# EAGLE design sim800c (EAGLE 6.1)
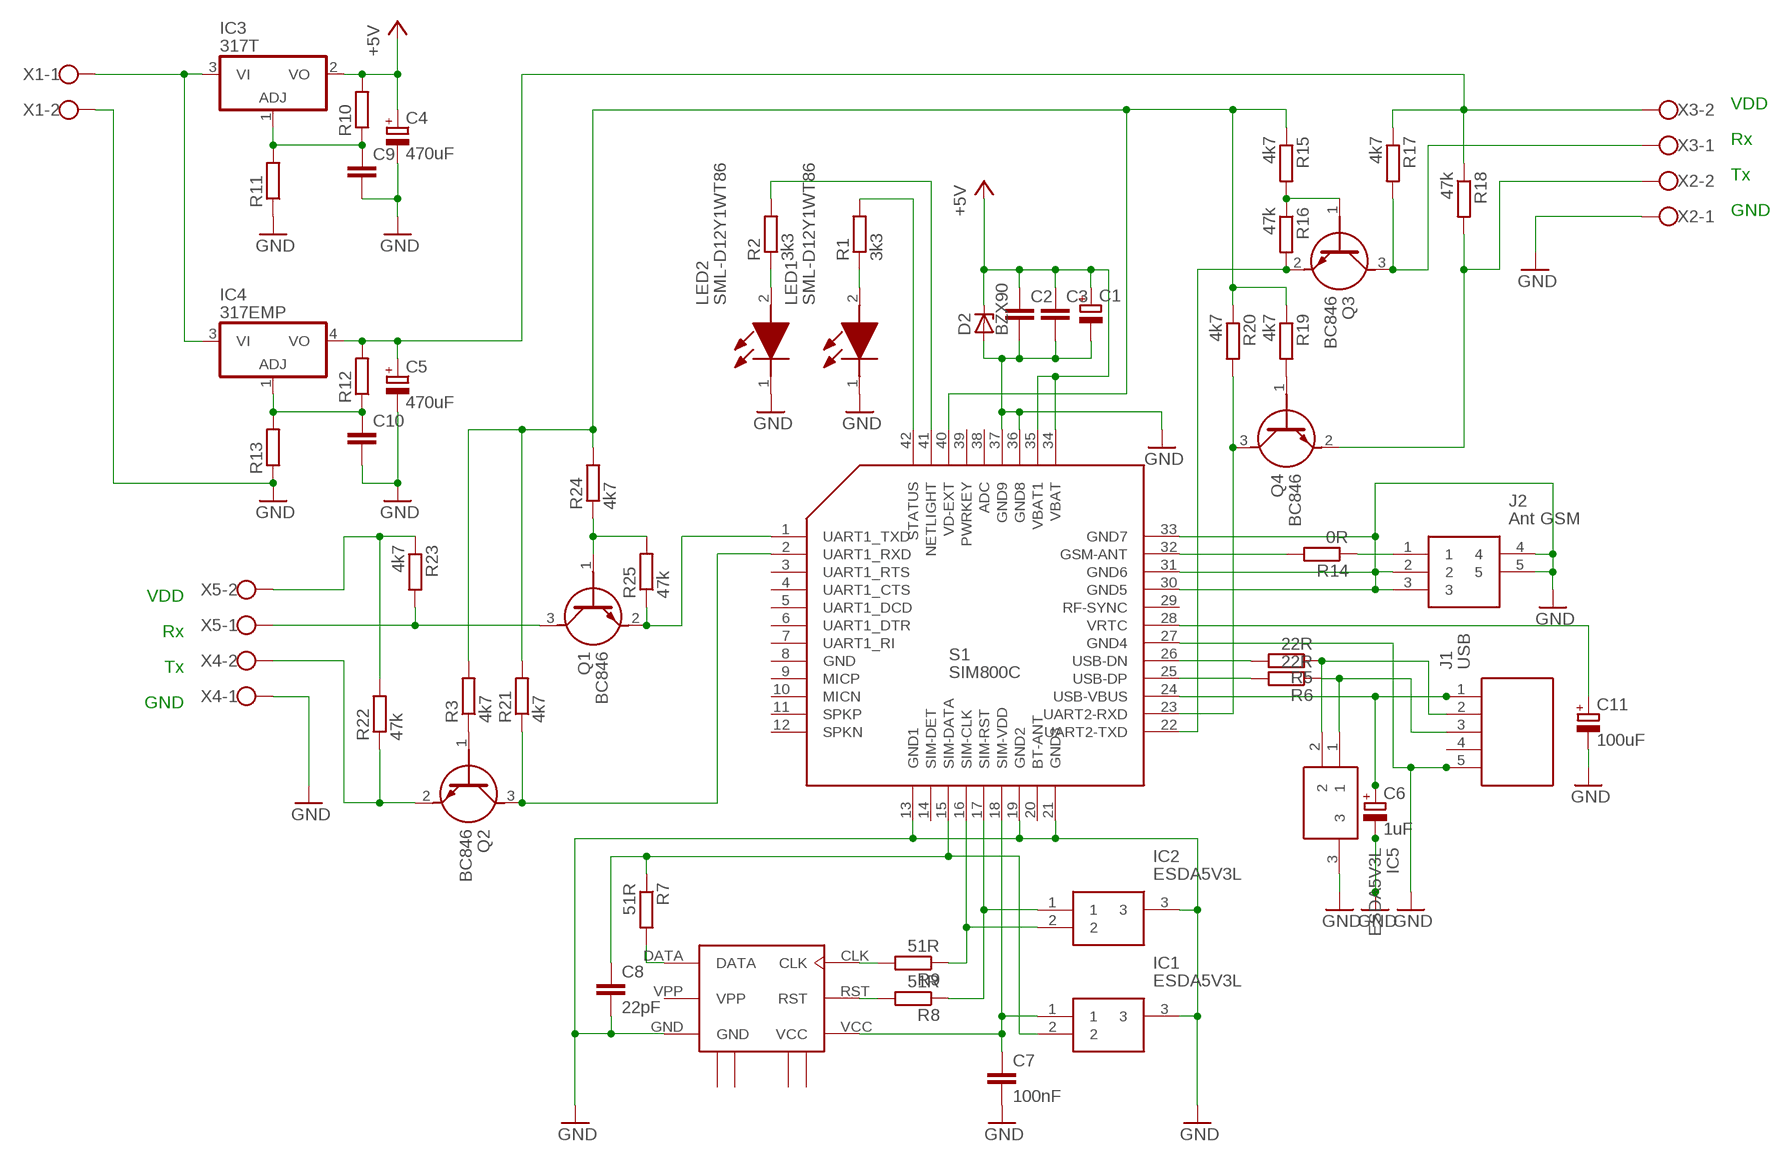
[diagram p0: schematic, sheet 1]

## Parts
C1  CPOL-EU140CLH-0810  [140CLH-0810]
C2  C-EUC0603  [C0603]
C3  C-EUC0603  [C0603]
C4  470uF  CPOL-EU140CLH-1010  [140CLH-1010]
C5  470uF  CPOL-EU140CLH-1010  [140CLH-1010]
C6  1uF  CPOL-EU153CLV-0405  [153CLV-0405]
C7  100nF  C-EUC0805  [C0805]
C8  22pF  C-EUC0805  [C0805]
C9  C-EUC0603  [C0603]
C10  C-EUC0603  [C0603]
C11  100uF  CPOL-EU140CLH-0810  [140CLH-0810]
D2  BZX90  [DO34Z7]
IC1  ESDA5V3L  [SOT105P242X150-3N]
IC2  ESDA5V3L  [SOT105P242X150-3N]
IC3  317T  [TO220H]
IC4  317EMP  [SOT223]
IC5  ESDA5V3L  [SOT105P242X150-3N]
J1  USB  ZX62R-B-5P_30_  [ZX62R-B-5P(30)]
J2  Ant GSM  1053354-1  [10533541]
LED1  SML-D12Y1WT86  [LEDC1608X55N]
LED2  SML-D12Y1WT86  [LEDC1608X55N]
Q1  BC846  BC846B,215  [SOT95P230X110-3N]
Q2  BC846  BC846B,215  [SOT95P230X110-3N]
Q3  BC846  BC846B,215  [SOT95P230X110-3N]
Q4  BC846  BC846B,215  [SOT95P230X110-3N]
R1  3k3  R-EU_M0805  [M0805]
R2  3k3  R-EU_M0805  [M0805]
R3  4k7  R-EU_M1206  [M1206]
R5  22R  R-EU_M1206  [M1206]
R6  22R  R-EU_M1206  [M1206]
R7  51R  R-EU_M1206  [M1206]
R8  51R  R-EU_M1206  [M1206]
R9  51R  R-EU_M1206  [M1206]
R10  R-EU_M1206  [M1206]
R11  R-EU_M1206  [M1206]
R12  R-EU_M1206  [M1206]
R13  R-EU_M1206  [M1206]
R14  0R  R-EU_M1206  [M1206]
R15  4k7  R-EU_M1206  [M1206]
R16  47k  R-EU_M1206  [M1206]
R17  4k7  R-EU_M1206  [M1206]
R18  47k  R-EU_M1206  [M1206]
R19  4k7  R-EU_M1206  [M1206]
R20  4k7  R-EU_M1206  [M1206]
R21  4k7  R-EU_M1206  [M1206]
R22  47k  R-EU_M1206  [M1206]
R23  4k7  R-EU_M1206  [M1206]
R24  4k7  R-EU_M1206  [M1206]
R25  47k  R-EU_M1206  [M1206]
S1  SIM800C  [SIM800C]
U$1  SCU-W0822XR-06  [SCU-W0822XR-06]
X1  W237-102  [W237-102]
X2  W237-102  [W237-102]
X3  W237-102  [W237-102]
X4  W237-102  [W237-102]
X5  W237-102  [W237-102]

## Nets
+5V: C1.+ C2.1 C3.1 C4.+ D2.C IC3.2(VO) R10.2 S1.34(VBAT) S1.35(VBAT1)
GND: C1.- C2.2 C3.2 C4.- C5.- C6.- C7.2 C8.2 C9.2 C10.2 C11.- D2.A IC1.3 IC2.3 IC5.3 J1.5 J2.2 J2.3 J2.4 J2.5 LED1.1(K) LED2.1(K) R11.1 R13.1 S1.13(GND1) S1.19(GND2) S1.21(GND3) S1.27(GND4) S1.30(GND5) S1.31(GND6) S1.33(GND7) S1.36(GND8) S1.37(GND9) U$1.GND X1.2 X2.1 X4.1
N$1: Q3.2(E) R16.2 S1.22(UART2-TXD)
N$2: R6.2 S1.25(USB-DP)
N$3: C6.+ J1.1 S1.24(USB-VBUS)
N$4: IC5.2 J1.2 R5.1
N$5: R14.2 S1.32(GSM-ANT)
N$6: LED1.2(A) R1.1
N$7: LED2.2(A) R2.1
N$8: Q1.3(C) R23.2 X5.1
N$9: Q1.1(B) R24.1 R25.2
N$10: IC5.1 J1.3 R6.1
N$12: Q2.3(C) R21.1 S1.2(UART1_RXD)
N$13: R7.2 U$1.DATA
N$14: IC2.2 R9.1 S1.16(SIM-CLK)
N$15: IC2.1 R8.1 S1.17(SIM-RST)
N$16: IC3.3(VI) IC4.3(VI) X1.1
N$17: C7.1 IC1.1 S1.18(SIM-VDD) U$1.VCC
N$18: C8.1 IC1.2 R7.1 S1.15(SIM-DATA)
N$19: C9.1 IC3.1(ADJ) R10.1 R11.2
N$20: R9.2 U$1.CLK
N$21: J2.1 R14.1
N$22: R8.2 U$1.RST
N$23: R2.2 S1.41(NETLIGHT)
N$24: R1.2 S1.42(STATUS)
N$25: C10.1 IC4.1(ADJ) R12.1 R13.2
N$26: C11.+ S1.28(VRTC)
N$27: Q3.1(B) R15.2 R16.1
N$28: C5.+ IC4.4(VO) R12.2 R17.1 R18.1 X3.2
N$29: R5.2 S1.26(USB-DN)
N$30: R3.2 R15.1 R19.1 R20.1 R21.2 R24.2 S1.40(VD-EXT)
N$31: Q2.2(E) R22.1 X4.2
N$32: Q3.3(C) R17.2 X3.1
N$33: Q2.1(B) R3.1
N$34: Q4.1(B) R19.2
N$35: Q4.3(C) R20.2 S1.23(UART2-RXD)
N$36: Q4.2(E) R18.2 X2.2
N$38: R22.2 R23.1 X5.2
S$3: Q1.2(E) R25.1 S1.1(UART1_TXD)
Unconnected: J1.4 S1.3(UART1_RTS) S1.4(UART1_CTS) S1.5(UART1_DCD) S1.6(UART1_DTR) S1.7(UART1_RI) S1.9(MICP) S1.10(MICN) S1.11(SPKP) S1.12(SPKN) S1.14(SIM-DET) S1.20(BT-ANT) S1.29(RF-SYNC) S1.38(ADC) S1.39(PWRKEY)

## Notes on the sheet
- VDD
- Rx
- Tx
- GND
- VDD
- Rx
- Tx
- GND

## Power pins joined to a net without a drawn wire
GND: S1.8(GND)
GND1: U$1.GND_1(GND1)
GND2: U$1.GND_2(GND2)
GND3: U$1.GND_3(GND3)
GND4: U$1.GND_4(GND4)
VPP: U$1.VPP

## Library data of the parts
C1 C4-C6 C11 = resistor:CPOL-EU: POLARIZED CAPACITOR, European symbol
C2 C3 C7-C10 = resistor:C-EU: CAPACITOR, European symbol
D2 = diode:BZX90: Z DIODE
IC1 IC2 IC5 = ESDA5V3L:ESDA5V3L: TVS Diode Array Uni-Directional ESDA5V3L Dual, 300W, SOT-23 3-Pin Source: Datasheet <http://www.st.com/web/en/resource/technical/document/datasheet/CD00002057.pdf>; ARROW_PART_NUMBER: ESD; ARROW_PRICE-STOCK: https://www.arrow.com/en/products/esda5v3l/stmicroelectronics; DESCRIPTION: TVS Diode Array Uni-Directional ESDA5V3L Dual, 300W, SOT-23 3-Pin; HEIGHT: 1.5mm; MANUFACTURER_NAME: STMicroelectronics; MANUFACTURER_PART_NUMBER: ESDA5V3L; MOUSER_PART_NUMBER: 511-ESDA5V3L; MOUSER_PRICE-STOCK: https://www.mouser.co.uk/ProductDetail/STMicroelectronics/ESDA5V3L?qs=bZskSr8d5Y%2FChJ9BTqyJUw%3D%3D
IC3 IC4 = linear:*317: Positive VOLTAGE REGULATOR
J1 = ZX62R-B-5P_30_:ZX62R-B-5P_30_: Hirose ZX, Straight SMT, Type B Version 2.0 Micro USB Connector Receptacle Source: Datasheet <http://www.farnell.com/datasheets/2360818.pdf>; ARROW_PART_NUMBER: ZX62R-B-5P(30); ARROW_PRICE-STOCK: https://www.arrow.com/en/products/zx62r-b-5p-30/hirose-electric; DESCRIPTION: Hirose ZX, Straight SMT, Type B Version 2.0 Micro USB Connector Receptacle; HEIGHT: mm; MANUFACTURER_NAME: Hirose; MANUFACTURER_PART_NUMBER: ZX62R-B-5P(30); MOUSER_PART_NUMBER: 798-ZX62R-B-5P30; MOUSER_PRICE-STOCK: https://www.mouser.co.uk/ProductDetail/Hirose-Connector/ZX62R-B-5P30?qs=4J5DPWWS9EAThzyZtJ4A7A%3D%3D
J2 = 1053354-1:1053354-1: SMA PCB SKT Source: Datasheet <https://www.te.com/commerce/DocumentDelivery/DDEController?Action=srchrtrv&DocNm=1307191_SMA_Connectors&DocType=CS&DocLang=English>; ARROW_PART_NUMBER: 1053354-1; ARROW_PRICE-STOCK: https://www.arrow.com/en/products/1053354-1/te-connectivity; DESCRIPTION: SMA PCB SKT; HEIGHT: 9.5mm; MANUFACTURER_NAME: TE Connectivity; MANUFACTURER_PART_NUMBER: 1053354-1
LED1 LED2 = SML-D12Y1WT86:SML-D12Y1WT86: LED Yellow 100mcd SMT 1608(0603) Source: Datasheet <https://componentsearchengine.com/Datasheets/1/SML-D12Y1WT86.pdf>; DESCRIPTION: LED Yellow 100mcd SMT 1608(0603); HEIGHT: 0.55mm; MANUFACTURER_NAME: ROHM Semiconductor; MANUFACTURER_PART_NUMBER: SML-D12Y1WT86; MOUSER_PART_NUMBER: 755-SML-D12Y1WT86; MOUSER_PRICE-STOCK: https://www.mouser.co.uk/ProductDetail/ROHM-Semiconductor/SML-D12Y1WT86?qs=M3jcYzEJUdG%2FAKvzZK%252Bz7w%3D%3D
Q1-Q4 = BC846B_215:BC846B,215: BC846 series - 65 V, 100 mA NPN general-purpose transistors Source: Datasheet <http://assets.nexperia.com/documents/data-sheet/BC846_SER.pdf>; ARROW_PART_NUMBER: BC846B,215; ARROW_PRICE-STOCK: https://www.arrow.com/en/products/bc846b215/nexperia; DESCRIPTION: BC846 series - 65 V, 100 mA NPN general-purpose transistors; HEIGHT: 1.1mm; MANUFACTURER_NAME: Nexperia; MANUFACTURER_PART_NUMBER: BC846B,215; MOUSER_PART_NUMBER: 771-BC846B-T/R; MOUSER_PRICE-STOCK: https://www.mouser.co.uk/ProductDetail/Nexperia/BC846B215?qs=me8TqzrmIYUpQR4a7Yjcpw%3D%3D
R1-R3 R5-R25 = resistor:R-EU_: RESISTOR, European symbol
S1 = Sim800c:SIM800C: SIM800c quad band GSM moude
U$1 = con-sim:SCU-W0822XR-06
X1-X5 = con-wago-500:W237-102: WAGO SCREW CLAMP; MPN: 237-102; OC_FARNELL: unknown; OC_NEWARK: 70K9898

## Board
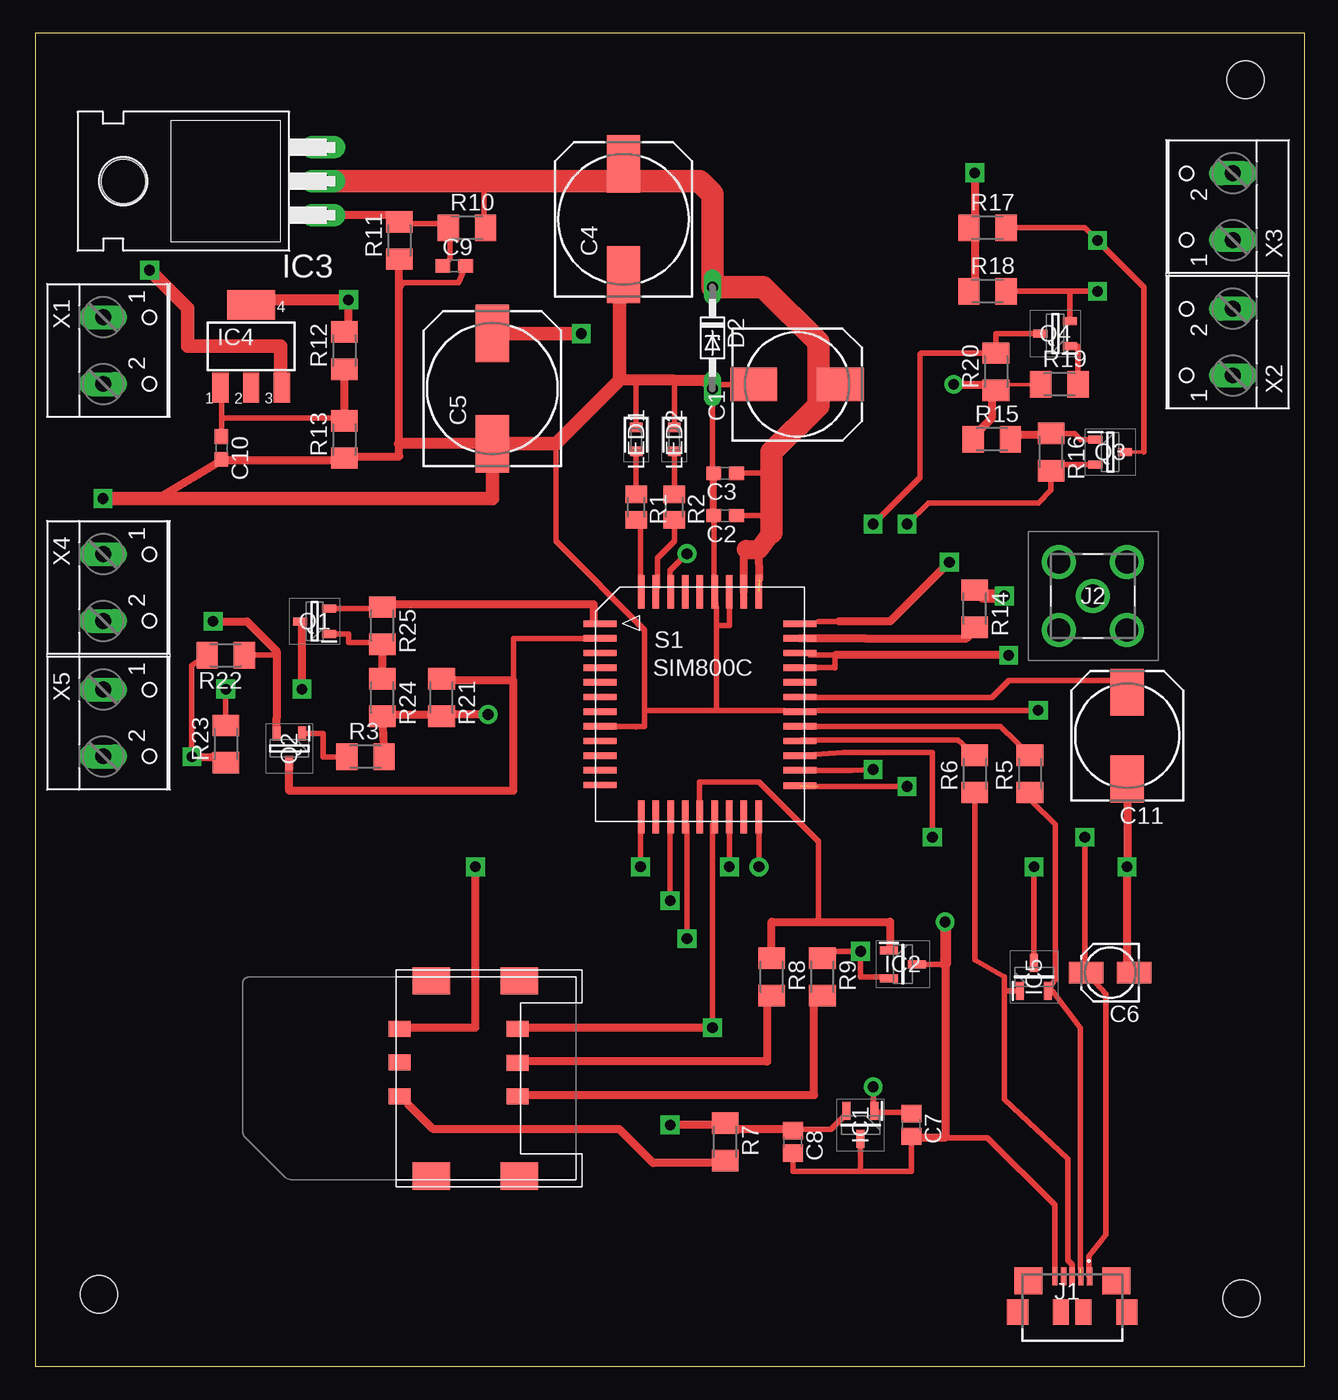
[diagram p1: board, top side]
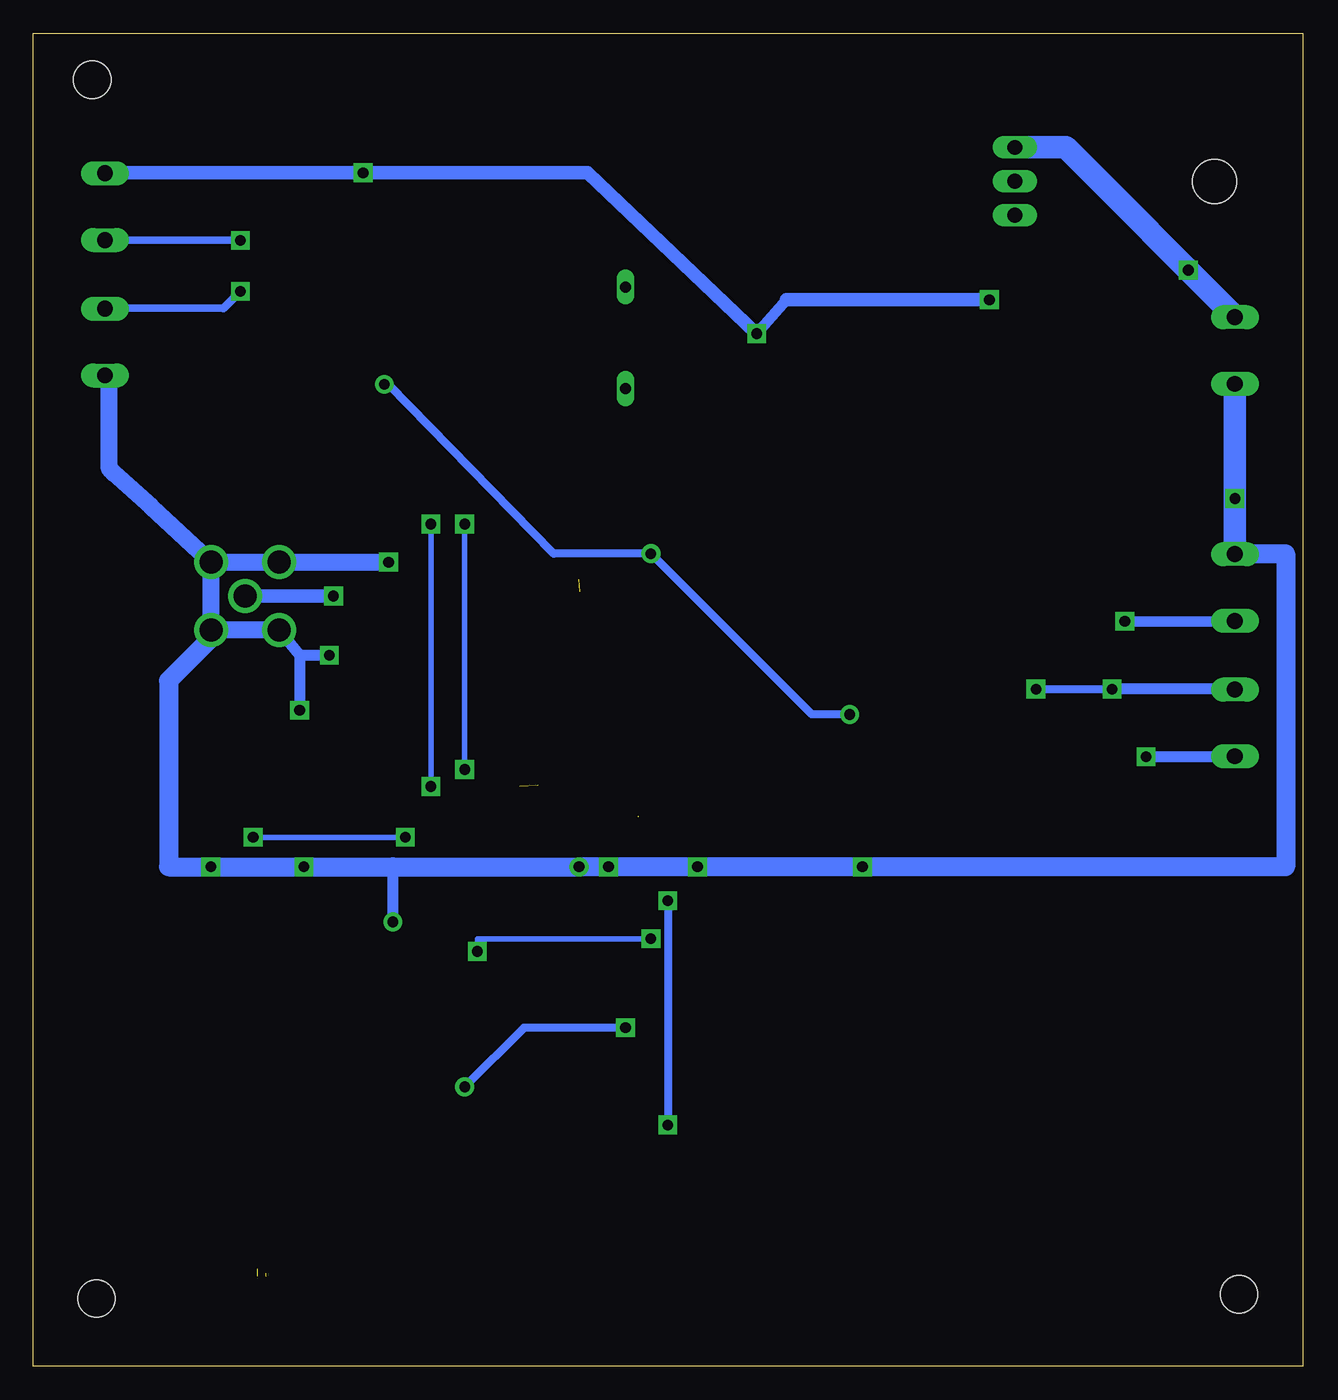
[diagram p2: board, bottom side, seen from below]

Size 95.23 x 100 mm. Coordinates in mm from the lower left corner, seen from the top.
Outline: 0,0 95.23,0 95.23,100 0,100 0,0
Copper layers (1*16): Top 0.035mm / dielectric 1.5mm / Bottom 0.035mm
Design rules: minimum track width 10mil, minimum drill 24mil, track to track 8mil, track to pad 8mil, pad to pad 8mil, via to via 8mil, smd to smd 8mil, copper to edge 40mil, drill to drill 8mil, minimum pad ring 10mil, minimum via ring 12mil, stop-mask expansion 4mil, vias tented up to drill 0mil, thermal gap 10mil
Holes 2.8 mm at 90.81,96.52 90.49,5.08 4.76,5.4

### Footprints (pad centres in the part's own frame; a part is rotated, then mirrored left to right if it is on the bottom)
140CLH-0810 = smd 3.5 x 2.5: + 3.25,0; - -3.25,0
C0603 = smd 1.1 x 1: 1 -0.85,0; 2 0.85,0
140CLH-1010 = smd 4.3 x 2.5: + 4.15,0; - -4.15,0
153CLV-0405 = smd 2.6 x 1.6: + 1.8,0; - -1.8,0
C0805 = smd 1.3 x 1.5: 1 -0.85,0; 2 0.85,0
DO34Z7 = drill 0.813 long: A 3.81,0; C -3.81,0
SOT105P242X150-3N = smd 1.35 x 0.6: 1 -1.05,1.05; 2 -1.05,-1.05; 3 1.05,0
TO220H = drill 1.118 long: 1 -2.54,-10.16; 2 0,-10.16; 3 2.54,-10.16 | hole 3.302: 0,4.826
SOT223 = smd 1.219 x 2.235: 1 -2.311,-3.099; 2 0,-3.099; 3 2.311,-3.099 | smd 3.6 x 2.2: 4 0,3.099
ZX62R-B-5P(30) = smd 0.4 x 1.35: 1 1.3,4.825; 2 0.65,4.825; 3 0,4.825; 4 -0.65,4.825; 5 -1.3,4.825 | smd 2.1 x 2: 6 -3.3,4.5; 7 3.3,4.5 | smd 1.6 x 1.9: 8 -4.1,2.15; 9 4.1,2.15 | smd 1.2 x 1.9: 10 -0.85,2.15; 11 0.85,2.15
10533541 = drill 1.7 pad 2.55: 1 -0.038,0; 2 -2.587,-2.55; 3 2.512,-2.55; 4 2.512,2.55; 5 -2.587,2.55
LEDC1608X55N = smd 0.7 x 0.95: 1 -0.9,0; 2 0.9,0
SOT95P230X110-3N = smd 1.05 x 0.6: 1 -1.1,0.95; 2 -1.1,-0.95; 3 1.1,0
M0805 = smd 1.3 x 1.6: 1 -0.95,0; 2 0.95,0
M1206 = smd 1.6 x 2: 1 -1.4,0; 2 1.4,0
SIM800C = smd 2.5 x 0.48: 1 -6.85,2.05; 2 -6.85,0.95; 3 -6.85,-0.15; 4 -6.85,-1.25; 5 -6.85,-2.35; 6 -6.85,-3.45; 7 -6.85,-4.55; 8 -6.85,-5.65; 9 -6.85,-6.75; 10 -6.85,-7.85; 11 -6.85,-8.95; 12 -6.85,-10.05; 22 8.15,-10.1; 23 8.15,-8.95; 24 8.15,-7.85; 25 8.15,-6.75; 26 8.15,-5.65; 27 8.15,-4.55; 28 8.15,-3.45; 29 8.15,-2.35; 30 8.15,-1.25; 31 8.15,-0.15; 32 8.15,0.95; 33 8.15,2.05 | smd 0.48 x 2.5: 13 -3.75,-12.45; 14 -2.65,-12.45; 15 -1.55,-12.45; 16 -0.45,-12.45; 17 0.65,-12.45; 18 1.75,-12.45; 19 2.85,-12.45; 20 3.95,-12.45; 21 5.05,-12.45; 34 5.05,4.45; 35 3.95,4.45; 36 2.85,4.45; 37 1.75,4.45; 38 0.65,4.45; 39 -0.45,4.45; 40 -1.55,4.45; 41 -2.65,4.45; 42 -3.75,4.45
SCU-W0822XR-06 = smd 1.65 x 1.2: CLK -4.42,1.36; DATA 4.43,1.35; GND 4.43,-3.73; RST -4.42,-1.18; VCC -4.42,-3.72; VPP 4.43,-1.19 | smd 2.8 x 2.05: GND_1 2.05,-7.32; GND_2 -4.57,-7.32; GND_3 2.05,7.32; GND_4 -4.57,7.32
W237-102 = drill 1.194 long: 1 -2.5,-1.27; 2 2.5,-1.27

### Placement (x,y rotation side)
C1  57.15,73.66 0 top
C2  51.75,63.82 180 top
C3  51.75,66.99 180 top
C4  44.13,86.04 90 top
C5  34.29,73.34 90 top
C6  80.64,29.53 180 top
C7  65.72,18.1 270 top
C8  56.83,16.83 270 top
C9  31.43,82.55 0 top
C10  13.97,68.9 270 top
C11  81.92,47.31 90 top
D2  50.8,77.15 270 top
IC1  61.91,18.1 270 top
IC2  65.09,30.16 0 top
IC3  11.43,88.9 90 top
IC4  16.19,76.52 0 top
IC5  74.93,29.21 90 top
J1  77.79,1.91 0 top
J2  79.38,57.78 0 top
LED1  45.09,69.53 270 top
LED2  47.94,69.53 270 top
Q1  20.95,55.88 180 top
Q2  19.05,46.35 270 top
Q3  80.64,68.58 0 top
Q4  76.52,77.47 180 top
R1  45.09,64.45 270 top
R2  47.94,64.45 270 top
R3  24.77,45.72 0 top
R5  74.61,44.45 90 top
R6  70.48,44.45 90 top
R7  51.75,16.83 270 top
R8  55.24,29.21 270 top
R9  59.05,29.21 270 top
R10  32.38,85.41 0 top
R11  27.3,84.45 90 top
R12  23.18,76.2 90 top
R13  23.18,69.53 90 top
R14  70.48,56.83 270 top
R15  71.75,69.53 0 top
R16  76.2,68.58 270 top
R17  71.44,85.41 0 top
R18  71.44,80.64 0 top
R19  76.83,73.66 0 top
R20  72.07,74.61 90 top
R21  30.48,50.16 270 top
R22  14.29,53.34 180 top
R23  14.29,46.67 90 top
R24  26.04,50.16 270 top
R25  26.04,55.56 270 top
S1  49.21,53.66 0 top
U$1  31.75,21.59 180 top
X1  6.35,76.2 270 top
X2  88.58,76.83 90 top
X3  88.58,87 90 top
X4  6.35,58.42 270 top
X5  6.35,48.26 270 top

### Tracks (layer width: path | path; a pad name or v marks a point on that pad's centre or on a via)
+5V  (1 unrouted)
  Top 0.254: 33.66,85.72 R10.2 | 58.74,73.66 C1.+ | 43.81,90.17 43.81,88.9 C4.+ 43.81,90.17
  Top 0.406: 33.66,88.9 33.66,85.72 | 53.16,61.1 53.34,61.28 | C3.1 55.24,66.99 | C2.1 55.24,63.82 | S1.34 54.29,58.11 54.29,58.1
  Top 0.61: S1.35 53.16,61.1 | 54.32,59.02 54.29,61.28
  Top 1.422: 53.34,61.28 54.29,61.28 55.24,62.55
  Top 1.676: IC3.2 33.66,88.9 43.81,88.9 49.85,88.9 50.8,87.95 D2.C 54.61,80.96 58.74,76.83 58.74,73.66 58.74,72.07 55.24,68.58 55.24,66.99 55.24,63.82 55.24,62.55
GND  (via drill 0.8)
  Top 0.254: 27.3,25.4 U$1.GND 27.94,25.4 | 66.04,17.14 C7.2 | 43.81,81.28 C4.- 43.81,81.92 43.81,83.19 | 58.42,49.21 S1.27 | 52.07,40.64 S1.19 | 56.2,49.21 S1.27 | 22.86,67.94 R13.1 23.5,68.26 | 34.29,69.22 C5.- | 58.1,53.34 S1.31 | 58.74,49.21 S1.27 | 58.74,55.88 S1.33 | 52.07,58.42 S1.36 | 50.8,64.14 C2.2
  Top 0.406: 61.91,14.61 65.72,14.61 C7.2 | 61.91,14.61 56.83,14.61 C8.2 | 60.33,55.88 58.74,55.88 | 45.09,73.98 LED1.1 | 56.2,49.21 51.12,49.21 | v52.07,37.47 52.07,40.64 | 45.72,49.21 45.72,55.24 39.05,61.91 39.05,69.22 | 45.72,49.21 51.12,49.21 | S1.8 45.72,48.01 | 45.72,48.01 45.09,47.94 | 45.72,48.01 45.72,49.21 | 58.1,53.34 60.01,53.34 60.01,52.39 59.99,52.41 S1.30 | 58.74,49.21 v75.25,49.21 | 51.12,49.21 51.12,55.56 | 51.12,55.56 51.12,56.83 S1.37 | 47.94,73.98 LED2.1 | S1.13 45.4,41.21 v45.4,37.47 | S1.21 54.29,41.21 v54.29,37.47 | IC2.3 68.26,30.16 | IC1.3 61.91,14.61 | 52.07,58.42 52.07,55.56 51.12,55.56 | J1.5 76.49,12.1 71.44,17.14 68.26,17.14 | IC5.3 v74.93,37.47 | C9.2 31.75,81.28 27.62,81.28 27.3,80.96 | C1.- 51.12,73.66 D2.A 50.8,64.14 50.8,63.82 50.9,63.92 C3.2 | C2.2 50.9,59.16
  Top 0.61: 66.04,17.14 68.26,17.14 68.26,30.16 | v68.58,60.33 64.14,55.88 60.33,55.88 | 27.94,25.4 33.02,25.4 v33.02,37.47 | 22.86,67.94 13.97,67.94 | R11.1 27.3,80.96 27.3,69.22 27.3,68.26 23.5,68.26 | C10.2 13.97,67.94 | 13.97,67.94 9.21,65.09 | v73.03,53.34 60.01,53.34 | C11.- v81.92,37.47 81.92,30.06 C6.-
  Top 0.813: v68.26,33.34 68.26,30.16 | 43.81,73.98 45.09,73.98 47.94,73.98 50.16,73.98 D2.A | 34.29,69.22 27.3,69.22
  Top 1.016: v5.08,65.09 9.21,65.09 34.29,65.09 34.29,69.22 39.05,69.22 43.81,73.98 43.81,81.28
  Bottom 0.254: J2.4 81.92,60.33 82.23,60.64 | 89.53,74.3 X2.1 | 81.92,55.24 81.92,54.61 J2.3 | 75.25,53.34 76.83,55.24 J2.2
  Bottom 0.406: 81.92,60.31 J2.4 79.99,60.33 78.73,60.33 J2.5
  Bottom 0.813: 75.25,53.34 v73.03,53.34 | 75.25,53.34 J2.2 | 75.25,53.34 v75.25,49.21 | 68.26,37.47 v68.26,33.34
  Bottom 1.27: 81.92,60.33 v68.58,60.33 | 82.23,60.64 86.36,64.45 89.22,66.99 89.53,67.31 89.53,74.3 | 76.83,55.24 81.92,55.24 81.92,60.31
  Bottom 1.422: 81.92,54.61 85.09,51.44 85.09,37.47 v81.92,37.47 v74.93,37.47 68.26,37.47 v54.29,37.47 v52.07,37.47 v45.4,37.47 v33.02,37.47 1.27,37.47
  Bottom 1.676: X1.2 v5.08,65.09 X4.1
N$1  (via drill 0.8)  (1 unrouted)
  Top 0.254: 76.2,67.63 R16.2
  Top 0.406: R16.2 76.2,65.72 75.25,64.77 66.99,64.77 v65.41,63.18 | 76.2,67.63 Q3.2 | 58.74,43.5 v65.41,43.5
  Bottom 0.406: v65.41,43.5 v65.41,63.18
N$2
  Top 0.254: 57.47,46.99 S1.25
  Top 0.406: 57.47,46.99 69.22,46.99 R6.2
N$3  (via drill 0.8)
  Top 0.254: 79.06,6.76 J1.1
  Top 0.406: 79.06,6.76 79.06,8.26 80.33,9.84 80.33,27.94 C6.+ 78.74,29.32 v78.74,39.69 | v67.31,39.69 67.31,46.04 60.64,46.04 S1.24
  Bottom 0.406: v67.31,39.69 v78.74,39.69
N$4  (1 unrouted)
  Top 0.406: R5.1 74.74,42.41 76.52,40.64 76.52,29.02 IC5.2 76.3,28.16 78.42,25.4 78.42,7.3 | 78.42,6.75 J1.2
N$5
  Top 0.254: 70.48,55.24 R14.2
  Top 0.61: 70.48,55.24 69.85,54.61 62.23,54.61 S1.32
N$6
  Top 0.406: R1.1 LED1.2
N$7
  Top 0.406: R2.1 LED2.2
N$8  (via drill 0.8)
  Top 0.254: 20,55.56 Q1.3
  Top 0.406: v14.29,50.8 R23.2
  Top 0.61: v20,50.8 20,55.56
  Bottom 0.61: v20,50.8 v14.29,50.8
  Bottom 0.813: v14.29,50.8 5.4,50.8 X5.1
N$9
  Top 0.406: Q1.1 23.5,54.93 23.5,54.29 26.04,54.29 R25.2
  Top 0.61: R25.2 R24.1
N$10  (1 unrouted)
  Top 0.406: R6.1 70.48,30.48 72.71,29.21 72.71,28.26 | 72.71,28.26 72.71,20 77.47,15.56 77.47,7.94 77.79,7.62 77.79,6.99 | IC5.1 72.81,28.16 72.71,28.26
N$11
  Bottom 1.422: 5.08,60.96 1.27,60.96 1.27,37.47
N$12
  Top 0.254: 30.48,51.44 R21.1 | 41.91,54.61 S1.2
  Top 0.406: 41.91,54.61 35.88,54.61 35.88,51.44
  Top 0.61: Q2.3 19.05,43.18 35.88,43.18 35.88,51.44 30.48,51.44
N$13
  Top 0.254: 27.94,19.68 U$1.DATA | 51.44,15.24 R7.2
  Top 0.61: 27.94,19.68 29.84,17.78 43.81,17.78 46.35,15.24 51.44,15.24
N$14  (via drill 0.8)
  Top 0.254: 48.9,40.64 S1.16 | 59.05,31.11 R9.1 | 64.14,29.21 IC2.2
  Top 0.406: v48.9,32.07 48.9,40.64 | 59.05,31.11 v61.91,31.11 61.91,29.21 64.14,29.21
  Bottom 0.406: v61.91,31.11 61.91,32.07 v48.9,32.07
N$15  (1 unrouted)
  Top 0.254: 64.14,31.43 IC2.1 64.14,31.11
  Top 0.406: 55.24,30.48 R8.1 | 58.74,33.34 58.74,39.37 54.29,43.81 49.85,43.81 49.85,41.27
  Top 0.61: R8.1 55.24,33.34 58.74,33.34 64.14,33.34 64.14,31.43
N$16  (via drill 0.8)
  Top 0.254: 18.41,73.66 IC4.3
  Top 1.016: v8.57,82.23 11.43,79.38 11.43,76.52 18.41,76.52 18.41,73.66
  Bottom 0.254: 5.08,78.74 X1.1 v8.57,82.23
  Bottom 1.676: 5.08,78.74 17.78,91.44 IC3.3
N$17  (via drill 0.8)
  Top 0.254: 62.87,19.05 IC1.1 62.87,19.68 | 65.41,19.05 C7.1 | 36.2,25.4 U$1.VCC | 50.8,40.64 S1.18
  Top 0.406: 65.41,19.05 62.87,19.05 | v62.87,20.95 62.87,19.68 | v50.8,25.4 50.8,40.64
  Top 0.61: v50.8,25.4 36.2,25.4
  Bottom 0.61: v62.87,20.95 58.42,25.4 v50.8,25.4
N$18  (via drill 0.8)
  Top 0.254: 60.96,19.05 IC1.2 | 57.15,17.78 C8.1 56.52,17.78 | 52.07,17.78 R7.1 | 47.62,40.64 S1.15 | 51.44,18.41 R7.1 | 51.44,18.1 51.44,17.78 R7.1
  Top 0.406: 60.96,19.05 59.69,17.78 57.15,17.78 | v47.62,34.92 47.62,40.64
  Top 0.61: 56.52,17.78 52.07,17.78 | 51.44,18.1 v47.62,18.1
  Bottom 0.61: v47.62,34.92 v47.62,18.1
N$19
  Top 0.254: 27.3,86.36 R11.2 27.3,85.72 | 31.11,85.09 R10.1 30.48,85.72
  Top 0.406: 31.11,85.09 31.11,83.08 C9.1 | 27.3,85.72 30.48,85.72
  Top 0.61: 27.3,86.36 IC3.1
N$20
  Top 0.254: 36.2,20.32 U$1.CLK | 58.42,27.3 R9.2
  Top 0.61: 36.2,20.32 58.42,20.32 58.42,27.3
N$21  (via drill 0.8)
  Top 0.254: 71.12,57.78 R14.1
  Top 1.016: v72.71,57.78 71.12,57.78
  Bottom 1.016: J2.1 v72.71,57.78
N$22
  Top 0.254: 36.2,22.86 U$1.RST | 54.93,27.94 55.24,27.94 R8.2
  Top 0.61: 36.2,22.86 54.93,22.86 54.93,27.94
N$23
  Top 0.254: R2.2 | 46.67,58.42 S1.41
  Top 0.406: 46.67,58.42 46.67,60.64 47.94,61.91 R2.2
N$24
  Top 0.406: S1.42 45.4,58.11 45.4,63.18 R1.2
N$25
  Top 0.254: 13.97,73.03 IC4.1 | 22.86,71.12 R13.2
  Top 0.406: 13.97,73.03 13.97,71.12 | 13.97,71.12 C10.1 | 22.86,71.12 13.97,71.12
  Top 0.61: R12.1 R13.2
N$26
  Top 0.254: 57.78,50.16 S1.28
  Top 0.406: 57.78,50.16 71.75,50.16 73.03,51.44 81.92,51.44 C11.+
N$27
  Top 0.254: 73.66,69.85 R15.2 | 76.2,69.85 R16.1
  Top 0.406: R16.1 77.97,69.98 78.42,69.53 Q3.1
  Top 0.61: 76.2,69.85 73.66,69.85
N$28  (via drill 0.8)
  Top 0.254: 34.29,78.11 C5.+ 34.29,77.47 | 22.86,78.11 R12.2 23.5,78.11 | 16.51,80.01 IC4.4 | 70.48,80.96 R18.1 | 70.48,85.41 R17.1
  Top 0.61: 23.5,78.11 v23.5,80.01 | 70.48,80.96 70.48,85.41 v70.48,89.53
  Top 0.813: 16.51,80.01 v23.5,80.01
  Top 1.016: 34.29,77.47 v40.96,77.47
  Bottom 0.813: 88.27,89.53 X3.2 | 38.73,80.01 v40.96,77.47
  Bottom 1.016: 88.27,89.53 v70.48,89.53 53.66,89.53 v40.96,77.47 | v23.5,80.01 38.73,80.01
N$29
  Top 0.406: S1.26 72.39,48.01 R5.2
N$30  (via drill 0.8)
  Top 0.254: 26.04,48.9 R24.2 | 30.48,48.9 R21.2 | 47.62,58.42 S1.40 | R19.1 72.07,73.66 R20.1 71.75,73.03 | 70.48,69.85 R15.1
  Top 0.406: v48.9,60.96 47.62,59.69 47.62,58.42
  Top 0.61: R24.2 R3.2 | 26.04,48.9 30.48,48.9 v33.97,48.9 | v68.9,73.66 72.07,73.66 | 70.48,69.85 71.75,71.12 71.75,73.03
  Bottom 0.254: 68.58,73.66 v68.9,73.66
  Bottom 0.61: v33.97,48.9 36.83,48.9 v48.9,60.96 56.2,60.96 68.58,73.66
N$31  (via drill 0.8)
  Top 0.254: 5.08,55.88 X4.2 | 18.1,53.66 18.1,53.34
  Top 0.406: 18.1,48.58 | 18.1,53.34 R22.1
  Top 0.61: v13.34,55.88 15.88,55.88 18.1,53.66 18.1,48.58 | Q2.2 18.1,48.58
  Bottom 0.813: v13.34,55.88 X4.2
N$32  (via drill 0.8)
  Top 0.254: 83.19,68.58 Q3.3
  Top 0.406: 83.19,68.58 83.19,80.96 v79.69,84.45 78.74,85.41 R17.2
  Bottom 0.61: v79.69,84.45 X3.1
N$33
  Top 0.406: Q2.1 21.59,47.45 21.59,45.72 R3.1
N$34
  Top 0.406: Q4.1 78.23,76.52 R19.2
N$35  (via drill 0.8)
  Top 0.406: Q4.3 72.07,77.47 R20.2 66.49,76.01 66.36,75.88 66.36,66.67 v62.87,63.18 | S1.23 61.22,44.71 v62.87,44.77
  Bottom 0.406: v62.87,44.77 v62.87,63.18
N$36  (via drill 0.8)
  Top 0.406: R18.2 77.47,80.64 | 77.47,80.64 v79.69,80.64 | Q4.2 77.62,80.5 77.47,80.64
  Bottom 0.61: v79.69,80.64 80.96,79.38 X2.2
N$38  (via drill 0.8)
  Top 0.254: 13.34,45.72 R23.1 14.29,45.72
  Top 0.406: R22.2 11.75,52.58 v11.75,45.72 14.29,45.72
  Top 0.61: v11.75,45.72 13.34,45.72
  Bottom 0.254: 5.08,45.72 X5.2
  Bottom 0.813: 5.08,45.72 v11.75,45.72
S$3
  Top 0.254: 26.04,57.15 R25.1 | 41.91,55.88 S1.1
  Top 0.406: Q1.2 25.9,56.83 R25.1
  Top 0.61: 26.04,57.15 41.91,57.15 41.91,55.88